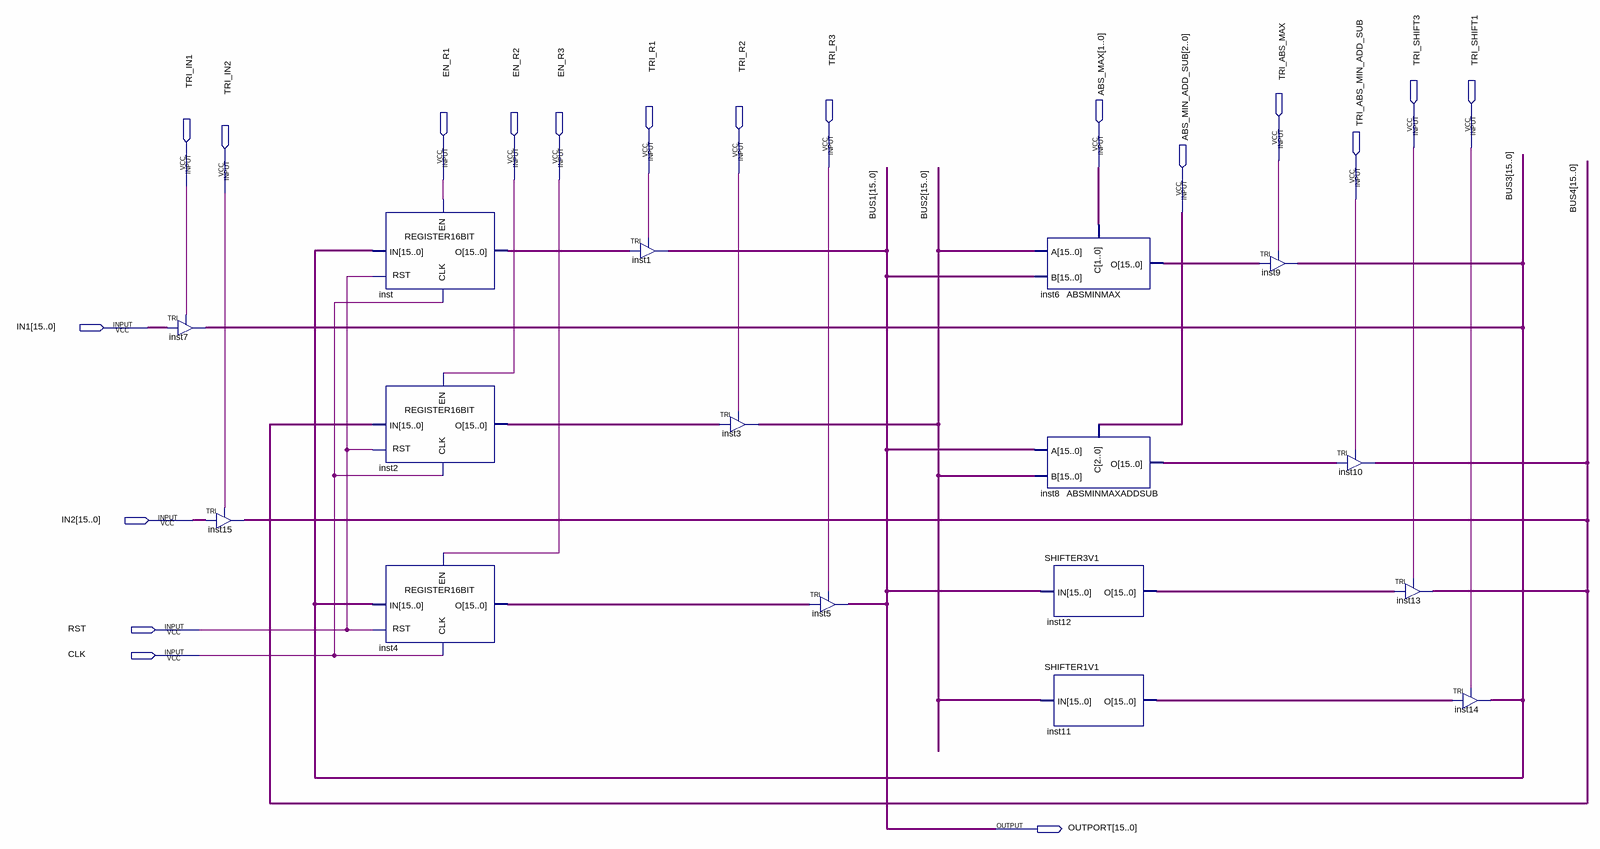
[diagram p0: schematic sheet]
// Quartus schematic DATAPATH_SB.bdf as structural Verilog: 16 symbols, 19 pins
module DATAPATH_SB (
  input  TRI_SHIFT3,
  input  TRI_SHIFT1,
  input  TRI_ABS_MAX,
  input  TRI_R3,
  input  [1:0] ABS_MAX,
  input  TRI_R1,
  input  TRI_R2,
  input  EN_R1,
  input  EN_R2,
  input  EN_R3,
  input  TRI_IN1,
  input  TRI_IN2,
  input  TRI_ABS_MIN_ADD_SUB,
  input  [2:0] ABS_MIN_ADD_SUB,
  input  [15:0] IN1,
  input  [15:0] IN2,
  input  RST,
  input  CLK,
  output [15:0] OUTPORT
);

  wire [15:0] BUS2, BUS3, BUS4, inst2_o, inst4_o, inst6_o, inst8_o, inst11_o, inst12_o, inst_o;

  TRI inst7[15:0] (.IN(IN1), .OE(TRI_IN1), .OUT(BUS3));
  TRI inst15[15:0] (.IN(IN2), .OE(TRI_IN2), .OUT(BUS4));
  REGISTER16BIT inst (.IN(BUS3), .EN(EN_R1), .CLK(CLK), .RST(RST), .O(inst_o));
  REGISTER16BIT inst2 (.IN(BUS4), .EN(EN_R2), .CLK(CLK), .RST(RST), .O(inst2_o));
  REGISTER16BIT inst4 (.IN(BUS3), .EN(EN_R3), .CLK(CLK), .RST(RST), .O(inst4_o));
  TRI inst1[15:0] (.IN(inst_o), .OE(TRI_R1), .OUT(OUTPORT));
  TRI inst3[15:0] (.IN(inst2_o), .OE(TRI_R2), .OUT(BUS2));
  TRI inst5[15:0] (.IN(inst4_o), .OE(TRI_R3), .OUT(OUTPORT));
  ABSMINMAX inst6 (.C(ABS_MAX), .A(BUS2), .B(OUTPORT), .O(inst6_o));
  ABSMINMAXADDSUB inst8 (.C(ABS_MIN_ADD_SUB), .A(OUTPORT), .B(BUS2), .O(inst8_o));
  SHIFTER3V1 inst12 (.IN(OUTPORT), .O(inst12_o));
  SHIFTER1V1 inst11 (.IN(BUS2), .O(inst11_o));
  TRI inst9[15:0] (.IN(inst6_o), .OE(TRI_ABS_MAX), .OUT(BUS3));
  TRI inst10[15:0] (.IN(inst8_o), .OE(TRI_ABS_MIN_ADD_SUB), .OUT(BUS4));
  TRI inst13[15:0] (.IN(inst12_o), .OE(TRI_SHIFT3), .OUT(BUS4));
  TRI inst14[15:0] (.IN(inst11_o), .OE(TRI_SHIFT1), .OUT(BUS3));

  // Other names for the same wires on the sheet: BUS1[15:0] = OUTPORT
endmodule
